# Altium schematic sheet Angular_Encoder.SchDoc
size A4; Author: İlker KESER; Revision: V1.0; SheetNumber: 9; SheetTotal: 9; Page: 9; Page Total: 9; Template: A4; Project Code: 02050838
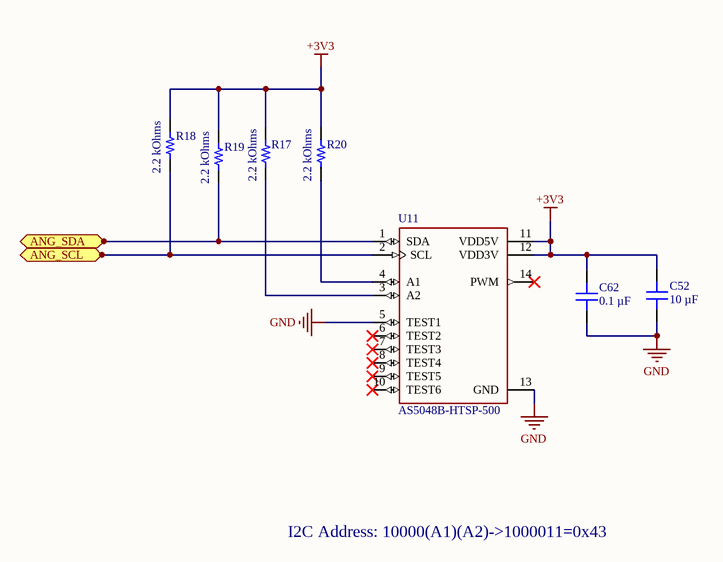
[diagram p0: Angular_Encoder.SchDoc]

## Parts
C52  10 µF  [CAP 0603_1608]
C62  0.1 µF  [CAP 0402_1005]
R17  2.2 kOhms  [YAGEO RES 0402_1005]
R18  2.2 kOhms  [YAGEO RES 0402_1005]
R19  2.2 kOhms  [YAGEO RES 0402_1005]
R20  2.2 kOhms  [YAGEO RES 0402_1005]
U11  AS5048B-HTSP-500  [AS5048B-HTSP-500]

## Ports
ANG_SCL (bidir, see Microcontroller[2A]), ANG_SDA (bidir, see Microcontroller[2B])

## Nets
+3V3: C52.2 C62.2 R17.2 R18.2 R19.2 R20.2 U11.11(VDD5V) U11.12(VDD3V)
GND: C52.1 C62.1 U11.5(TEST1) U11.13(GND)
ANG_SCL: R18.1 U11.2(SCL) ; port ANG_SCL
ANG_SDA: R19.1 U11.1(SDA) ; port ANG_SDA
NetR17_1: R17.1 U11.3(A2)
NetR20_1: R20.1 U11.4(A1)

Not connected (* = marked no-connect by the designer): U11 6(TEST2)* 7(TEST3)* 8(TEST4)* 9(TEST5)* 10(TEST6)* 14(PWM)*

## Notes on the sheet
- I2C Address: 10000(A1)(A2)->1000011=0x43
- TITLE:
- DOCUMENT NAME:
- PROJECT CODE:
- TEMPLATE:
- REVISION:
- Sheet:
- of
- AUTHOR:

## Library data of the parts
C52 = CC0603MRX5R7BB106: CAP CER 10UF 16V X5R 0603; manufacturer: Yageo; Tolerance: ±20%; Part Number: CC0603MRX5R7BB106; Capacitance: 10 µF; Applications: General Purpose; componentlink1description: Datasheet; componentlink1url: https://www.yageo.com/upload/media/product/productsearch/datasheet/mlcc/UPY-GPHC_X5R_4V-to-50V_26.pdf; componentlink2description: DigiKey Link; componentlink2url: https://www.digikey.com/en/products/detail/yageo/CC0603MRX5R7BB106/5195229; Device Package: 0603 (1608 Metric); lastupdated: 9.02.2024 20:09:51; Lifecycle Status: Active; Minimum Order: 1; Mounting Type: Surface Mount, MLCC; Operating Temperature: -55°C ~ 85°C; Package / Case: 0603 (1608 Metric); packaging: TapeAndReel; partid: 41163; Part Status: Active; price: 0.08; series: CC; Size / Dimension: 0.063" L x 0.031" W (1.60mm x 0.80mm); Supplier 1: DigiKey; Supplier Part Number 1: 311-1822-1-ND; Temperature Coefficient: X5R; Thickness (Max): 0.035" (0.90mm); value: 10 µF; Voltage - Rated: 16V
C62 = C0402C104M9PAC7867: CAP CER 0.1UF 6.3V X5R 0402; manufacturer: KEMET; Tolerance: ±20%; Part Number: C0402C104M9PAC7867; Capacitance: 0.1 µF; Applications: Bypass, Decoupling; componentlink1description: Datasheet; componentlink1url: https://api.kemet.com/component-edge/download/datasheet/C0402C104M9PACTU.pdf; componentlink2description: DigiKey Link; componentlink2url: https://www.digikey.com/en/products/detail/kemet/C0402C104M9PAC7867/2196244; Device Package: 0402 (1005 Metric); lastupdated: 9.02.2024 20:04:15; Lifecycle Status: Active; Minimum Order: 1; Mounting Type: Surface Mount, MLCC; Operating Temperature: -55°C ~ 85°C; Package / Case: 0402 (1005 Metric); packaging: CutTape; partid: 33676; Part Status: Active; price: 0.01; series: SMD Comm X5R; Size / Dimension: 0.039" L x 0.020" W (1.00mm x 0.50mm); Supplier 1: DigiKey; Supplier Part Number 1: 399-C0402C104M9PAC7867CT-ND; Temperature Coefficient: X5R; Thickness (Max): 0.022" (0.55mm); value: 0.1 µF; Voltage - Rated: 6.3V
R17-R20 = RC0402FR-072K2L: RES 2.2K OHM 1% 1/16W 0402; Manufacturer: Yageo; Power (Watts): 0.063W, 1/16W; Temperature Coefficient: ±100ppm/°C; Part Number: RC0402FR-072K2L; Value: 2.2 kOhms; ComponentLink1Description: Datasheet; ComponentLink1URL: https://www.yageo.com/upload/media/product/productsearch/datasheet/rchip/PYu-RC_Group_51_RoHS_L_10.pdf; ComponentLink2Description: DigiKey Link; ComponentLink2URL: https://www.digikey.com/en/products/detail/yageo/RC0402FR-072K2L/726553; Composition: Thick Film; Device Package: 0402 (1005 Metric); Features: Moisture Resistant; Height - Seated (Max): 0.016" (0.40mm); LastUpdated: 25.07.2024 09:18:11; Lifecycle Status: Active; Minimum Order: 1; Number of Terminations: 2; Operating Temperature: -55°C ~ 155°C; Package / Case: 0402 (1005 Metric); Packaging: CutTape; PartId: 17607; Part Status: Active; Price: 0.01; Resistance: 2.2 kOhms; Series: RC_L; Size / Dimension: 0.039" L x 0.020" W (1.00mm x 0.50mm); Supplier 1: DigiKey; Supplier Part Number 1: 311-2.20KLRCT-ND; Supplier Device Package: 0402; Tolerance: ±1%
U11 = AS5048B-HTSP-500: Hall Effect Sensor Angle External Magnet, Not Included Gull Wing; Manufacturer: ams-OSRAM USA INC.; Rotation Angle - Electrical, Mechanical: 0° ~ 360°, Continuous; Output: I2C, PWM; Voltage - Supply: 3V ~ 3.6V, 4.5V ~ 5.5V; ComponentLink1Description: Datasheet; ComponentLink1URL: https://s3.amazonaws.com/snapeda/datasheet/AS5048B-HTSP-500_ams.pdf; ComponentLink2Description: Digikey Link; ComponentLink2URL: https://www.digikey.com/en/products/detail/ams-osram-usa-inc/AS5048B-HTSP-500/3188616; For Measuring: Angle; Technology: Hall Effect; Actuator Type: External Magnet, Not Included; Mounting Type: Surface Mount; Termination Style: Gull Wing; Operating Temperature: -40°C ~ 150°C; Package / Case: 14-TSSOP (0.173", 4.40mm Width); Supplier Device Package: 14-TSSOP